# Altium project PCB.PrjPcb
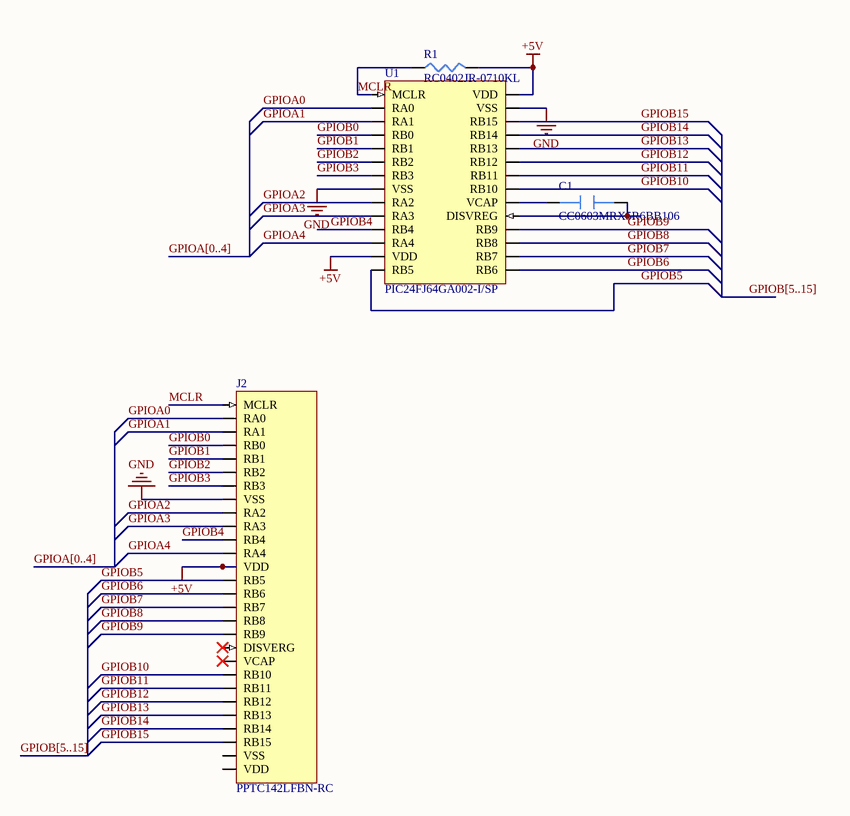
[diagram p0: Sheet1.SchDoc]
1 sheet, 4 parts. Net scope: global (net labels, ports and power ports of the same name join across sheets).
Board file: PCB1.PcbDoc

## Sheet Sheet1.SchDoc
size A; SheetNumber: 1; SheetTotal: 1

### Parts
C1  CC0603MRX5R6BB106  [RC0402JR-0710KL]
J2  PPTC142LFBN-RC  [PPTC142LFBN-RC]
R1  RC0402JR-0710KL  [RC0402JR-0710KL]
U1  PIC24FJ64GA002-I/SP  [PIC24FJ64GA002-I/SP]

### Nets
+5V: J2.13(VDD) R1.1 U1.13(VDD) U1.28(VDD)
GND: J2.8(VSS) U1.8(VSS) U1.27(VSS)
GPIOA0: J2.2(RA0) U1.2(RA0)
GPIOA1: J2.3(RA1) U1.3(RA1)
GPIOA2: J2.9(RA2) U1.9(RA2)
GPIOA3: J2.10(RA3) U1.10(RA3)
GPIOA4: J2.12(RA4) U1.12(RA4)
GPIOB0: J2.4(RB0) U1.4(RB0)
GPIOB1: J2.5(RB1) U1.5(RB1)
GPIOB2: J2.6(RB2) U1.6(RB2)
GPIOB3: J2.7(RB3) U1.7(RB3)
GPIOB4: J2.11(RB4) U1.11(RB4)
GPIOB5: J2.14(RB5) U1.14(RB5)
GPIOB6: J2.15(RB6) U1.15(RB6)
GPIOB7: J2.16(RB7) U1.16(RB7)
GPIOB8: J2.17(RB8) U1.17(RB8)
GPIOB9: J2.18(RB9) U1.18(RB9)
GPIOB10: J2.21(RB10) U1.21(RB10)
GPIOB11: J2.22(RB11) U1.22(RB11)
GPIOB12: J2.23(RB12) U1.23(RB12)
GPIOB13: J2.24(RB13) U1.24(RB13)
GPIOB14: J2.25(RB14) U1.25(RB14)
GPIOB15: J2.26(RB15) U1.26(RB15)
MCLR: J2.1(MCLR) R1.2 U1.1(MCLR)
NetC1_1: C1.1 U1.20(VCAP)
NetC1_2: C1.2 U1.19(DISVREG)

Not connected (* = marked no-connect by the designer): J2 19(DISVERG)* 20(VCAP)* 27(VSS) 28(VDD)

### Buses and harness runs
bus GPIOA[0..4]
bus GPIOB[5..15]

### Library data of the parts
C1 = CC0603MRX5R6BB106: Ceramic Capacitor, Multilayer, Ceramic, 10V, 20% +Tol, 20% -Tol, X5R, 15% TC, 10uF, Surface Mount, 0603; Manufacturer: Yageo; Multilayer: Yes; Supplier: Digikey; Supplier Part Number: 311-1817-1-ND; Manufacturer Part Number: CC0603MRX5R6BB106; RoHS: Yes; Category: Ceramic Capacitors; Stock: 192913; Pricing: 1=0.18, 10=0.119, 50=0.0752, 100=0.0602, 500=0.04348, 1000=0.03847 (USD); Mounting Technology: Surface Mount; Pins: 2; Dielectric Material: Ceramic; Package Shape: Rectangular; Case/Package: 0603; Terminal Finish: Nickel; Min Operating Temperature: -55°C; Max Operating Temperature: 85°C; JESD-609 Code: e3; Value: 10uF; Capacitor Type: Ceramic; Tolerance  (fill in as +-): 20%; Package Style: SMTMeter; Packaging: Tape and Reel; Tolerance (fill in as +-): 20%; Rated DC Voltage (URdc): 10V; Temperature Characteristics Code: X5R; Termination: Wraparound; Length: 1.6mm; Width: 0.8mm; Height: 0.8mm; Reach SVHC Compliant: Yes; RoHS Compliant: Yes; ComponentLink1URL: https://datasheet.ciiva.com:443/pdfs/VipMasterIC/IC/YAGO/YAGO-S-A0006851646/YAGO-S-A0006851646-1.pdf?src-supplier=IHS+Markit; ComponentLink1Description: https://datasheet.ciiva.com:443/pdfs/VipMasterIC/IC/YAGO/YAGO-S-A0006851646/YAGO-S-A0006851646-1.pdf?src-supplier=IHS+Markit; ComponentLink2URL: http://www.mouser.com/ds/2/447/UPY-GPHC_X5R_4V-to-50V_25-1131599.pdf?src-supplier=Mouser; ComponentLink2Description: http://www.mouser.com/ds/2/447/UPY-GPHC_X5R_4V-to-50V_25-1131599.pdf?src-supplier=Mouser; ComponentLink3URL: http://www.yageo.com/documents/recent/UPY-GPHC_X5R_4V-to-50V_25.pdf?src-supplier=Digikey; ComponentLink3Description: http://www.yageo.com/documents/recent/UPY-GPHC_X5R_4V-to-50V_25.pdf?src-supplier=Digikey; ComponentLink4URL: https://datasheet.octopart.com/CC0603MRX5R6BB106-Yageo-datasheet-158238148.pdf?src-supplier=Newark; ComponentLink4Description: https://datasheet.octopart.com/CC0603MRX5R6BB106-Yageo-datasheet-158238148.pdf?src-supplier=Newark
J2 = PPTC142LFBN-RC: Board Connector, 28 Contact(s), 2 Row(s), Female, Straight, 0.1 inch Pitch, Solder Terminal, Locking; Manufacturer: Sullins; Manufacturer Series: PP; Contact Pattern: RECTANGULAR; Contact Style: SQ PIN-SKT; Number Of Connectors: 1; Number Of PCB Rows: 2; Polarization Key: POLARIZED HOUSING; Rated Current (Signal): 3A; Number of Contacts: 28; Body Breadth: 0.197inch; Body Depth: 0.334inch; Body Length: 1.42inch; PCB Contact Row Spacing: 2.54mm; Reference Standard: UL; Reliability: COMMERCIAL; Supplier: Digikey; Supplier Part Number: S7082-ND; Manufacturer Part Number: PPTC142LFBN-RC; RoHS: Yes; Category: Connectors; Stock: 2110; Pricing: 1=1.72, 10=1.497, 80=1.33775, 440=1.11475, 1000=0.9555, 5000=0.91 (USD); Mounting Technology: Board; Contact Material: Bronze; Contact Finish - Mating: SN; Contact Finish - Termination: TIN; Insulation Material: Polyester; Connector Type: BOARD CONNECTOR; Contact Gender: Female; Mounting Style: STRAIGHT; Number of Rows Loaded: 2; PCB Contact Pattern: RECTANGULAR; Termination: Solder; Mating Contact Pitch: 0.1inch; Mating Contact Row Spacing: 0.1inch; Mounting Option 1: LOCKING; Terminal Length: 0.125inch; Terminal Pitch: 2.54mm; Reach SVHC Compliant: Yes; RoHS Compliant: Yes; ComponentLink1URL: https://datasheet.ciiva.com:443/pdfs/VipMasterIC/IC/SUCS/SUCSS00270/SUCSS00270-1.pdf?src-supplier=IHS+Markit; ComponentLink1Description: https://datasheet.ciiva.com:443/pdfs/VipMasterIC/IC/SUCS/SUCSS00270/SUCSS00270-1.pdf?src-supplier=IHS+Markit; ComponentLink2URL: http://sullinscorp.com/catalogs/101_PAGE114-115_.100_FEMALE_HDR.pdf?src-supplier=Digikey; ComponentLink2Description: http://sullinscorp.com/catalogs/101_PAGE114-115_.100_FEMALE_HDR.pdf?src-supplier=Digikey
R1 = RC0402JR-0710KL: Fixed Resistor, Metal Glaze/thick Film, 0.0625W, 10000ohm, 50V, 5% +/-Tol, 100ppm/Cel, Surface Mount, 0402; Manufacturer: Yageo; Additional Feature: LASER TRIMMABLE; Power: 62.5mW; Rated Temperature: 70°C; Value: 10kR; Temperature Coefficient: 100ppm/°C; Package Height: 0.35mm; Package Length: 1mm; Package Width: 0.5mm; Supplier: Future Electronics; Supplier Part Number: 4356762; Manufacturer Part Number: RC0402JR-0710KL; RoHS: Yes; Category: Chip SMD Resistors; Stock: 3760000; Pricing: 10000=0.0008, 100000=0.0007, 300000=0.0007, 750000=0.0007, 2000000=0.0006 (USD); Mounting Technology: Surface Mount; Pins: 2; Package Shape: Rectangular; Case/Package: 0402; Terminal Finish: Nickel; Min Operating Temperature: -55°C; Max Operating Temperature: 155°C; Tolerance: 5%; JESD-609 Code: e3; Resistor Type: FIXED RESISTOR; Construction: Chip; Package Style: SMTMeter; Packaging: Tape and Reel; Technology: METAL GLAZE/THICK FILM; Termination: Wraparound; Working Voltage: 50V; Reach SVHC Compliant: Yes; RoHS Compliant: Yes; ComponentLink1URL: https://datasheet.ciiva.com:443/pdfs/VipMasterIC/IC/YAGO/YAGO-S-A0008145938/YAGO-S-A0008145938-1.pdf?src-supplier=IHS+Markit; ComponentLink1Description: https://datasheet.ciiva.com:443/pdfs/VipMasterIC/IC/YAGO/YAGO-S-A0008145938/YAGO-S-A0008145938-1.pdf?src-supplier=IHS+Markit; ComponentLink2URL: https://datasheet.ciiva.com/7850/1018594-7850136.pdf?src-supplier=Element14; ComponentLink2Description: https://datasheet.ciiva.com/7850/1018594-7850136.pdf?src-supplier=Element14; ComponentLink3URL: https://datasheet.ciiva.com/7850/1018594-7850137.pdf?src-supplier=Element14; ComponentLink3Description: https://datasheet.ciiva.com/7850/1018594-7850137.pdf?src-supplier=Element14; ComponentLink4URL: https://datasheet.ciiva.com/2452/pyu-r-int-thick-7-2452626.pdf?src-supplier=Digikey; ComponentLink4Description: https://datasheet.ciiva.com/2452/pyu-r-int-thick-7-2452626.pdf?src-supplier=Digikey; ComponentLink5URL: https://datasheet.ciiva.com/2452/pyu-r-int-thick-7-2452627.pdf?src-supplier=Digikey; ComponentLink5Description: https://datasheet.ciiva.com/2452/pyu-r-int-thick-7-2452627.pdf?src-supplier=Digikey; ComponentLink6URL: https://datasheet.ciiva.com/2452/pyu-r-int-thick-7-2452628.pdf?src-supplier=Digikey; ComponentLink6Description: https://datasheet.ciiva.com/2452/pyu-r-int-thick-7-2452628.pdf?src-supplier=Digikey; ComponentLink7URL: https://datasheet.ciiva.com/12669/pyu-rc0402-51-rohs-l-6-r-12669687.pdf?src-supplier=Mouser; ComponentLink7Description: https://datasheet.ciiva.com/12669/pyu-rc0402-51-rohs-l-6-r-12669687.pdf?src-supplier=Mouser
U1 = PIC24FJ64GA002-I/SP: Microcontroller, 16-Bit, FLASH, PIC CPU, 32MHz, CMOS, PDIP28; Manufacturer: Microchip; Package Body Material: Plastic; Number of I/O Lines: 21; Package Equivalence Code: DIP28,.3; Power Supplies: 2.5,2.5/3.3V; Speed: 32RPM; Max Supply Current: 20mA; Max Supply Voltage: 3.6V; Min Supply Voltage: 2V; Surface Mount: No; Qualification Status: Not Qualified; Supplier: Digikey; Supplier Part Number: PIC24FJ64GA002-I/SP-ND; Manufacturer Part Number: PIC24FJ64GA002-I/SP; RoHS: Yes; Category: Microcontrollers; Stock: 1019; Pricing: 1=4.35, 25=3.98, 100=3.6 (USD); Case/Package: DIP; Pins: 28; Package Shape: Rectangular; Terminal Finish: Tin; Min Operating Temperature: -40°C; Max Operating Temperature: 85°C; JESD-609 Code: e3; Clock Frequency: 32MHz; JESD-30 Code: R-PDIP-T28; Package Style: IN-LINEMeter; Technology: CMOS; Terminal Form: Through Hole; Terminal Position: DUAL; Length: 34.671mm; Width: 7.62mm; Height - Seated (Max): 5.08mm; Terminal Pitch: 2.54mm; Temperature Grade: INDUSTRIAL; Reach SVHC Compliant: Yes; RoHS Compliant: Yes; ComponentLink1URL: https://datasheet.ciiva.com:443/pdfs/VipMasterIC/IC/MCHP/MCHPS05315/MCHPS05315-1.pdf?src-supplier=IHS+Markit; ComponentLink1Description: https://datasheet.ciiva.com:443/pdfs/VipMasterIC/IC/MCHP/MCHPS05315/MCHPS05315-1.pdf?src-supplier=IHS+Markit; ComponentLink2URL: https://datasheet.ciiva.com/6640/39881d-6640011.pdf?src-supplier=Digikey; ComponentLink2Description: https://datasheet.ciiva.com/6640/39881d-6640011.pdf?src-supplier=Digikey; ComponentLink3URL: https://datasheet.ciiva.com/4839/39714a-75400-4839926.pdf?src-supplier=Mouser; ComponentLink3Description: https://datasheet.ciiva.com/4839/39714a-75400-4839926.pdf?src-supplier=Mouser; ComponentLink4URL: https://datasheet.ciiva.com/16877/70046338-16877117.pdf?src-supplier=Allied+Electronics; ComponentLink4Description: https://datasheet.ciiva.com/16877/70046338-16877117.pdf?src-supplier=Allied+Electronics; ComponentLink5URL: https://datasheet.ciiva.com/16351/filehandler-aspxddocname-en529429-16351639.pdf?src-supplier=Future+Electronics; ComponentLink5Description: https://datasheet.ciiva.com/16351/filehandler-aspxddocname-en529429-16351639.pdf?src-supplier=Future+Electronics; ComponentLink6URL: https://datasheet.ciiva.com/7790/39881d-7790101.pdf?src-supplier=Element14; ComponentLink6Description: https://datasheet.ciiva.com/7790/39881d-7790101.pdf?src-supplier=Element14; ComponentLink7URL: https://datasheet.ciiva.com/29330/651773-da-01-en-ic-mcu-pic24fj64ga002-i-sp-sdip-28-mcp-29330534.pdf?src-supplier=Conrad; ComponentLink7Description: https://datasheet.ciiva.com/29330/651773-da-01-en-ic-mcu-pic24fj64ga002-i-sp-sdip-28-mcp-29330534.pdf?src-supplier=Conrad